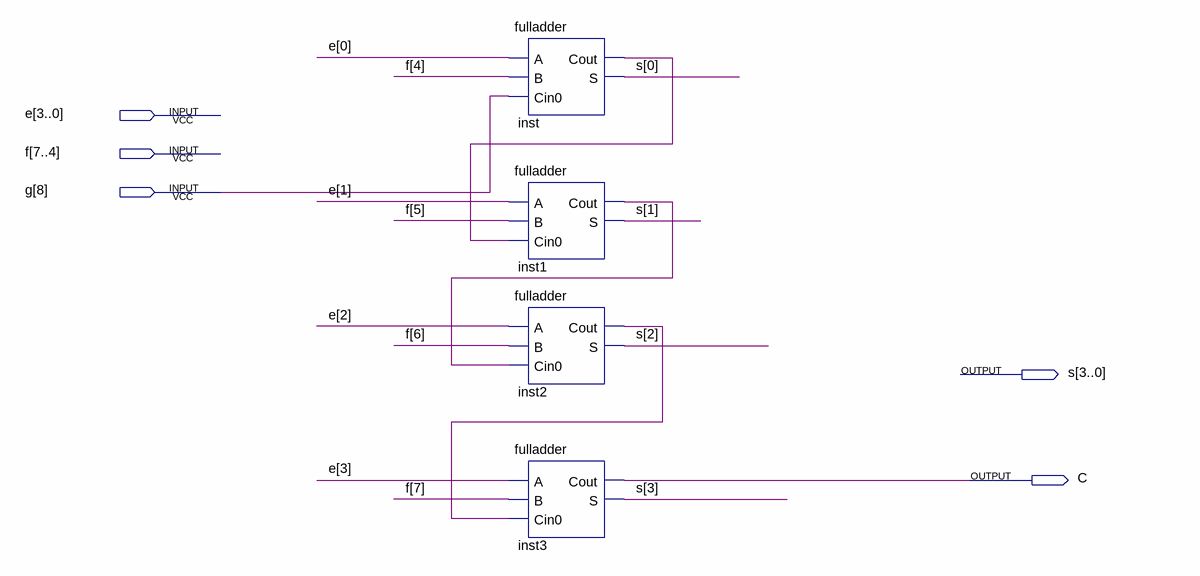
[diagram p0: schematic sheet]
// Quartus schematic rca.bdf as structural Verilog: 4 symbols, 5 pins
module rca (
  input  [3:0] e,
  input  [7:4] f,
  input  [8:8] g,
  output [3:0] s,
  output C
);

  wire inst1_cout, inst2_cout, inst_cout;

  fulladder inst (.A(e[0]), .B(f[4]), .Cin0(g[8]), .Cout(inst_cout), .S(s[0]));
  fulladder inst1 (.A(e[1]), .B(f[5]), .Cin0(inst_cout), .Cout(inst1_cout), .S(s[1]));
  fulladder inst2 (.A(e[2]), .B(f[6]), .Cin0(inst1_cout), .Cout(inst2_cout), .S(s[2]));
  fulladder inst3 (.A(e[3]), .B(f[7]), .Cin0(inst2_cout), .Cout(C), .S(s[3]));
endmodule
